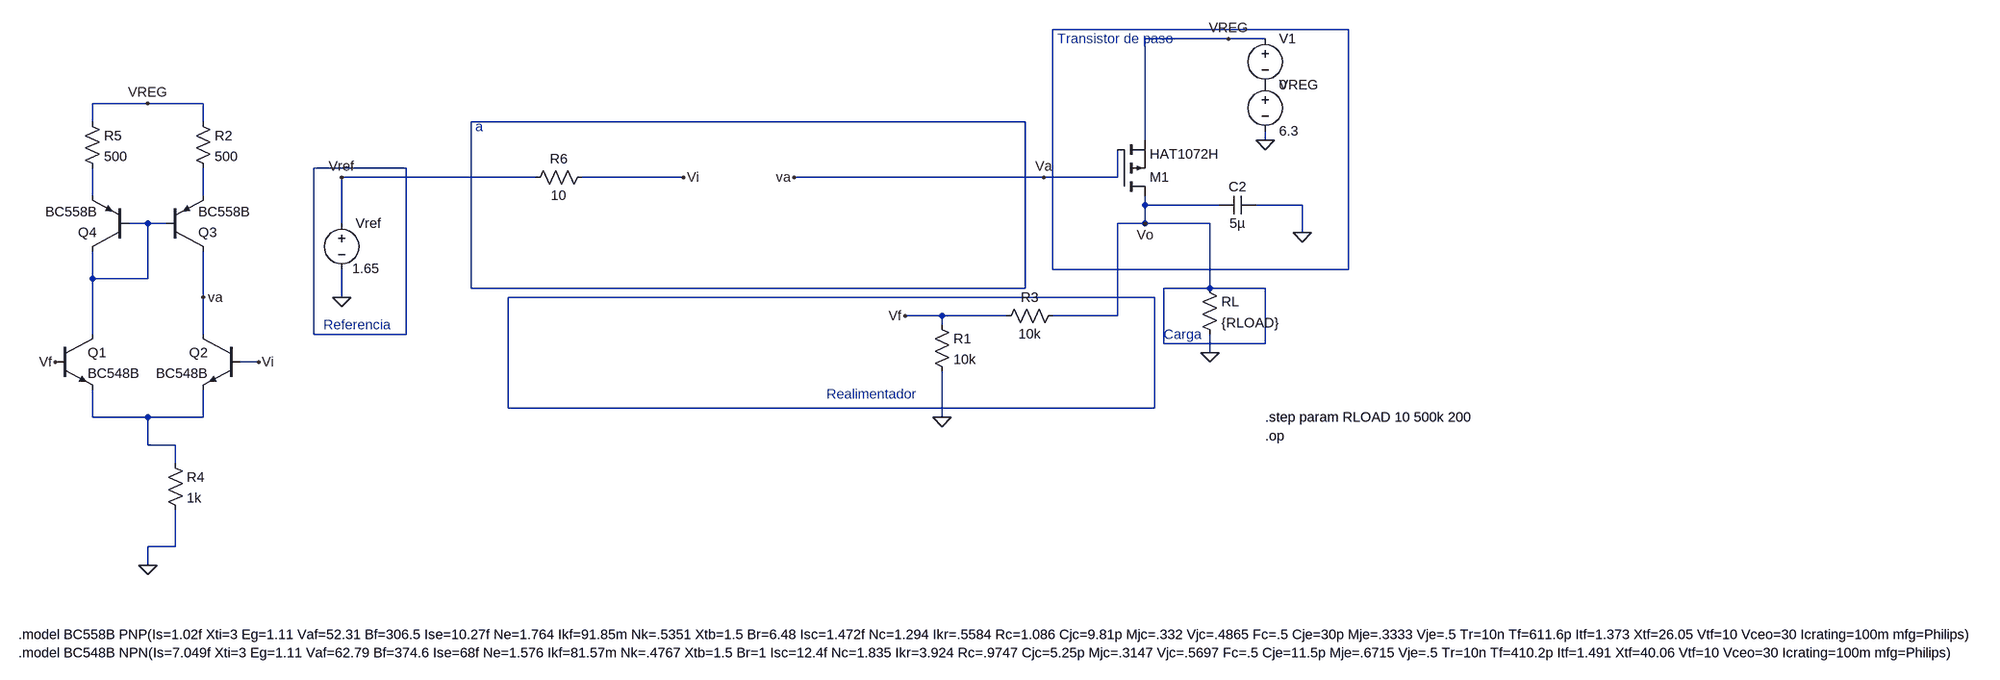
[diagram p0: schematic Diagrama_en_bloques_regulador.asc]
Diagrama_en_bloques_regulador.asc, the LTspice schematic file:
Version 4
SHEET 1 2480 952
WIRE 1008 -144 496 -144
WIRE 800 -128 656 -128
WIRE 864 -128 800 -128
WIRE -1072 -16 -1168 -16
WIRE -976 -16 -1072 -16
WIRE -1168 16 -1168 -16
WIRE -976 16 -976 -16
WIRE 448 16 -512 16
WIRE 656 48 656 -128
WIRE 864 48 864 32
WIRE -624 96 -784 96
WIRE -400 112 -736 112
WIRE -144 112 -320 112
WIRE 480 112 48 112
WIRE 608 112 608 64
WIRE 608 112 480 112
WIRE -1168 144 -1168 96
WIRE -976 144 -976 96
WIRE 656 160 656 144
WIRE 784 160 656 160
WIRE 928 160 848 160
WIRE -1072 192 -1104 192
WIRE -1040 192 -1072 192
WIRE -736 192 -736 112
WIRE 656 192 656 160
WIRE 656 192 608 192
WIRE 768 192 656 192
WIRE 928 208 928 160
WIRE 496 272 496 -144
WIRE 1008 272 1008 -144
WIRE 1008 272 496 272
WIRE -1168 288 -1168 240
WIRE -1072 288 -1072 192
WIRE -1072 288 -1168 288
WIRE -512 304 -512 16
WIRE 448 304 448 16
WIRE 448 304 -512 304
WIRE 768 304 768 192
WIRE 768 304 688 304
WIRE 864 304 768 304
WIRE -976 320 -976 240
WIRE -736 320 -736 272
WIRE 672 320 -448 320
WIRE 304 352 240 352
WIRE 416 352 304 352
WIRE 608 352 608 192
WIRE 608 352 496 352
WIRE 304 368 304 352
WIRE -1168 384 -1168 288
WIRE -976 384 -976 320
WIRE -784 384 -784 96
WIRE -624 384 -624 96
WIRE -624 384 -784 384
WIRE 688 400 688 304
WIRE 864 400 864 304
WIRE 864 400 688 400
WIRE 768 416 768 384
WIRE -880 432 -912 432
WIRE -448 512 -448 320
WIRE 672 512 672 320
WIRE 672 512 -448 512
WIRE -1168 528 -1168 480
WIRE -1072 528 -1168 528
WIRE -976 528 -976 480
WIRE -976 528 -1072 528
WIRE 304 528 304 448
WIRE -1072 576 -1072 528
WIRE -1024 576 -1072 576
WIRE -1024 608 -1024 576
WIRE -1024 752 -1024 688
WIRE -1024 752 -1072 752
WIRE -1072 784 -1072 752
FLAG 768 416 0
FLAG -736 320 0
FLAG 480 112 Va
FLAG -736 112 Vref
FLAG 304 528 0
FLAG 656 192 Vo
FLAG 864 48 0
FLAG 928 208 0
FLAG -1072 784 0
FLAG 240 352 Vf
FLAG -1072 -16 VREG
FLAG -144 112 Vi
FLAG -976 320 va
FLAG 48 112 va
FLAG -880 432 Vi
FLAG -1232 432 Vf
FLAG 800 -128 VREG
SYMBOL voltage -736 176 R0
WINDOW 123 0 0 Left 0
WINDOW 39 0 0 Left 0
WINDOW 3 66 94 Right 2
SYMATTR Value 1.65
SYMATTR InstName Vref
SYMBOL res 752 288 R0
SYMATTR InstName RL
SYMATTR Value {RLOAD}
SYMBOL res 288 352 R0
SYMATTR InstName R1
SYMATTR Value 10k
SYMBOL res 512 336 R90
WINDOW 0 0 56 VBottom 2
WINDOW 3 32 56 VTop 2
SYMATTR InstName R3
SYMATTR Value 10k
SYMBOL pmos 608 144 M180
SYMATTR InstName M1
SYMATTR Value HAT1072H
SYMBOL voltage 864 -64 R0
WINDOW 123 0 0 Left 0
WINDOW 39 0 0 Left 0
SYMATTR InstName VREG
SYMATTR Value 6.3
SYMBOL voltage 864 -144 R0
WINDOW 123 0 0 Left 0
WINDOW 39 0 0 Left 0
SYMATTR InstName V1
SYMATTR Value 0
SYMBOL cap 848 144 R90
WINDOW 0 0 32 VBottom 2
WINDOW 3 32 32 VTop 2
SYMATTR InstName C2
SYMATTR Value 5µ
SYMBOL npn -1232 384 R0
SYMATTR InstName Q1
SYMATTR Value BC548B
SYMBOL npn -912 384 M0
SYMATTR InstName Q2
SYMATTR Value BC548B
SYMBOL res -1040 592 R0
SYMATTR InstName R4
SYMATTR Value 1k
SYMBOL pnp -1040 240 M180
SYMATTR InstName Q3
SYMATTR Value BC558B
SYMBOL pnp -1104 240 R180
SYMATTR InstName Q4
SYMATTR Value BC558B
SYMBOL res -992 0 R0
SYMATTR InstName R2
SYMATTR Value 500
SYMBOL res -1184 0 R0
SYMATTR InstName R5
SYMATTR Value 500
SYMBOL res -304 96 R90
WINDOW 0 0 56 VBottom 2
WINDOW 3 32 56 VTop 2
SYMATTR InstName R6
SYMATTR Value 10
TEXT -768 368 Left 2 ;Referencia
TEXT 104 488 Left 2 ;Realimentador
TEXT -504 24 Left 2 ;a
TEXT 504 -128 Left 2 ;Transistor de paso
TEXT 688 384 Left 2 ;Carga
TEXT 864 528 Left 2 !.step param RLOAD 10 500k 200
TEXT -1296 904 Left 2 !.model BC558B PNP(Is=1.02f Xti=3 Eg=1.11 Vaf=52.31 Bf=306.5 Ise=10.27f Ne=1.764 Ikf=91.85m Nk=.5351 Xtb=1.5 Br=6.48 Isc=1.472f Nc=1.294 Ikr=.5584 Rc=1.086 Cjc=9.81p Mjc=.332 Vjc=.4865 Fc=.5 Cje=30p Mje=.3333 Vje=.5 Tr=10n Tf=611.6p Itf=1.373 Xtf=26.05 Vtf=10 Vceo=30 Icrating=100m mfg=Philips)
TEXT -1296 936 Left 2 !.model BC548B NPN(Is=7.049f Xti=3 Eg=1.11 Vaf=62.79 Bf=374.6 Ise=68f Ne=1.576 Ikf=81.57m Nk=.4767 Xtb=1.5 Br=1 Isc=12.4f Nc=1.835 Ikr=3.924 Rc=.9747 Cjc=5.25p Mjc=.3147 Vjc=.5697 Fc=.5 Cje=11.5p Mje=.6715 Vje=.5 Tr=10n Tf=410.2p Itf=1.491 Xtf=40.06 Vtf=10 Vceo=30 Icrating=100m mfg=Philips)
TEXT 864 560 Left 2 !.op

The netlist it stands for:
* Diagrama_en_bloques_regulador.asc
Vref Vref 0 1.65
RL Vo 0 {RLOAD}
R1 Vf 0 10k
R3 Vo Vf 10k
M1 Vo Va VREG VREG HAT1072H
VREG P001 0 6.3
V1 VREG P001 0
C2 0 Vo 5µ
Q1 N006 Vf N008 0 BC548B
Q2 Va Vi N008 0 BC548B
R4 N008 0 1k
Q3 Va N006 N005 0 BC558B
Q4 N006 N006 N004 0 BC558B
R2 VREG N005 500
R5 VREG N004 500
R6 Vi Vref 10
.model NPN NPN
.model PNP PNP
.lib standard.bjt
.model NMOS NMOS
.model PMOS PMOS
.lib standard.mos
* Referencia
* Realimentador
* a
* Transistor de paso
* Carga
.step param RLOAD 10 500k 200
.model BC558B PNP(Is=1.02f Xti=3 Eg=1.11 Vaf=52.31 Bf=306.5 Ise=10.27f Ne=1.764 Ikf=91.85m Nk=.5351 Xtb=1.5 Br=6.48 Isc=1.472f Nc=1.294 Ikr=.5584 Rc=1.086 Cjc=9.81p Mjc=.332 Vjc=.4865 Fc=.5 Cje=30p Mje=.3333 Vje=.5 Tr=10n Tf=611.6p Itf=1.373 Xtf=26.05 Vtf=10 Vceo=30 Icrating=100m mfg=Philips)
.model BC548B NPN(Is=7.049f Xti=3 Eg=1.11 Vaf=62.79 Bf=374.6 Ise=68f Ne=1.576 Ikf=81.57m Nk=.4767 Xtb=1.5 Br=1 Isc=12.4f Nc=1.835 Ikr=3.924 Rc=.9747 Cjc=5.25p Mjc=.3147 Vjc=.5697 Fc=.5 Cje=11.5p Mje=.6715 Vje=.5 Tr=10n Tf=410.2p Itf=1.491 Xtf=40.06 Vtf=10 Vceo=30 Icrating=100m mfg=Philips)
.op
.backanno
.end